# Altium project paizhen.PrjPcb
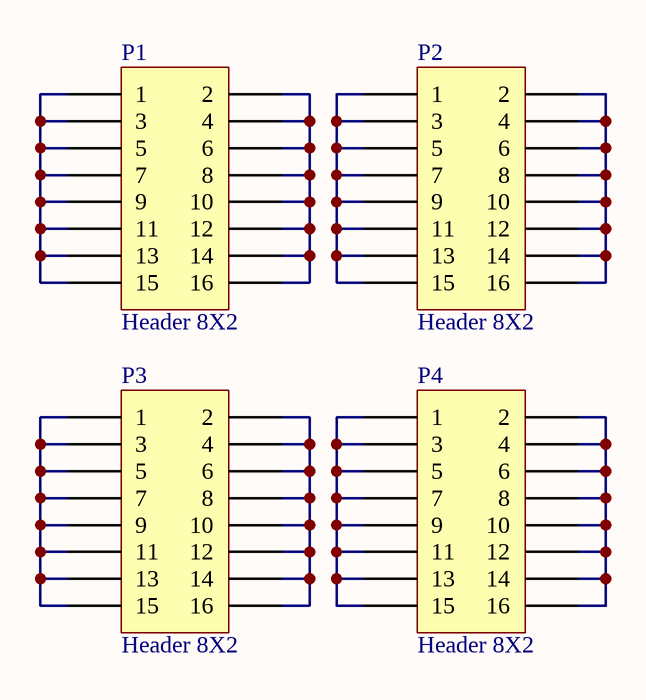
[diagram p0: paizhen.SchDoc]
1 sheet, 4 parts. Net scope: global (net labels, ports and power ports of the same name join across sheets).
Board file: paizhen.PcbDoc

## Sheet paizhen.SchDoc
size A4

### Parts
P1  Header 8X2  [HDR2X8]
P2  Header 8X2  [HDR2X8]
P3  Header 8X2  [HDR2X8]
P4  Header 8X2  [HDR2X8]

### Nets
NetP1_1: P1.1 P1.3 P1.5 P1.7 P1.9 P1.11 P1.13 P1.15
NetP1_2: P1.2 P1.4 P1.6 P1.8 P1.10 P1.12 P1.14 P1.16
NetP2_1: P2.1 P2.3 P2.5 P2.7 P2.9 P2.11 P2.13 P2.15
NetP2_2: P2.2 P2.4 P2.6 P2.8 P2.10 P2.12 P2.14 P2.16
NetP3_1: P3.1 P3.3 P3.5 P3.7 P3.9 P3.11 P3.13 P3.15
NetP3_2: P3.2 P3.4 P3.6 P3.8 P3.10 P3.12 P3.14 P3.16
NetP4_1: P4.1 P4.3 P4.5 P4.7 P4.9 P4.11 P4.13 P4.15
NetP4_2: P4.2 P4.4 P4.6 P4.8 P4.10 P4.12 P4.14 P4.16

### Library data of the parts
P1-P4 = Header 8X2: Header, 8-Pin, Dual row; LatestRevisionDate: 17-Jul-2002; LatestRevisionNote: Re-released for DXP Platform.; Publisher: Altium Limited